# EAGLE design prototype (EAGLE 7.7.0)
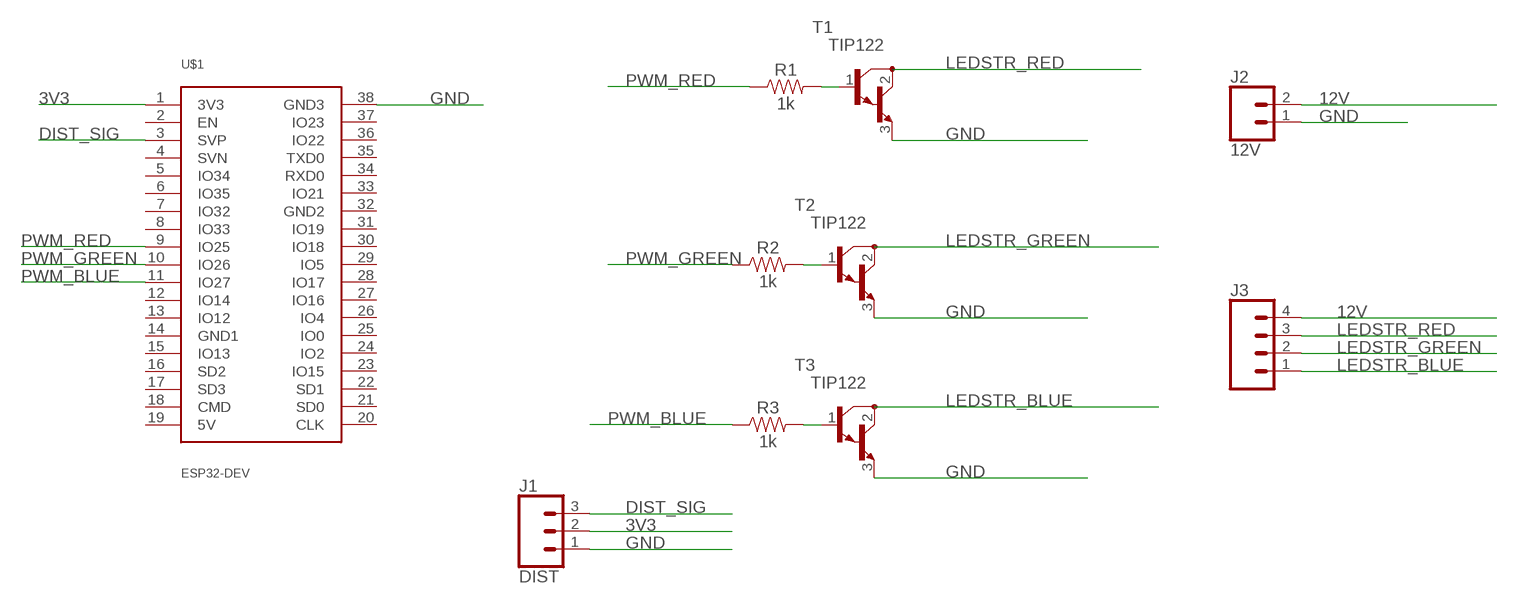
[diagram p0: schematic, sheet 1]

## Parts
J1  DIST  CONN_03LONGPADS  [1X03_LONGPADS]
J2  12V  CONN_02PTH3  [1X02_LONGPADS]
J3  CONN_04LONGPADS  [1X04_LONGPADS]
R1  1k  1KOHM-HORIZ-1/4W-1%  [AXIAL-0.3]
R2  1k  1KOHM-HORIZ-1/4W-1%  [AXIAL-0.3]
R3  1k  1KOHM-HORIZ-1/4W-1%  [AXIAL-0.3]
T1  TIP122  [TO220]
T2  TIP122  [TO220]
T3  TIP122  [TO220]
U$1  ESP32-DEV  [ESP32-DEV]

## Nets
3V3: J1.2 U$1.1(3V3)
12V: J2.2 J3.4
DIST_SIG: J1.3 U$1.3(SVP)
GND: J1.1 J2.1 T1.3(E) T2.3(E) T3.3(E) U$1.38(GND3)
LEDSTR_BLUE: J3.1 T3.2(C)
LEDSTR_GREEN: J3.2 T2.2(C)
LEDSTR_RED: J3.3 T1.2(C)
N$1: R1.P$2 T1.1(B)
N$2: R2.P$2 T2.1(B)
N$3: R3.P$2 T3.1(B)
PWM_BLUE: R3.P$1 U$1.11(IO27)
PWM_GREEN: R2.P$1 U$1.10(IO26)
PWM_RED: R1.P$1 U$1.9(IO25)
Unconnected: U$1.2(EN) U$1.4(SVN) U$1.5(IO34) U$1.6(IO35) U$1.7(IO32) U$1.8(IO33) U$1.12(IO14) U$1.13(IO12) U$1.14(GND1) U$1.15(IO13) U$1.16(SD2) U$1.17(SD3) U$1.18(CMD) U$1.19(5V) U$1.20(CLK) U$1.21(SD0) U$1.22(SD1) U$1.23(IO15) U$1.24(IO2) U$1.25(IO0) U$1.26(IO4) U$1.27(IO16) U$1.28(IO17) U$1.29(IO5) U$1.30(IO18) U$1.31(IO19) U$1.32(GND2) U$1.33(IO21) U$1.34(RXD0) U$1.35(TXD0) U$1.36(IO22) U$1.37(IO23)

## Library data of the parts
J1 = SparkFun-Connectors:CONN_03: Multi connection point. Often used as Generic Header-pin footprint for 0.1 inch spaced/style header connections On any of the 0.1 inch spaced packages, you can populate with these: Break Away Headers - Straight <https://www.sparkfun.com/products/116> (PRT-00116) Break Away Male Headers - Right Angle <https://www.sparkfun.com/products/553> (PRT-00553) Female Headers <https://www.sparkfun.com/products/115> (PRT-00115) Break Away Headers - Machine Pin <https://www.sparkfun.com/products/117> (PRT-00117) Break Away Female Headers - Swiss Machine Pin <https://www.sparkfun.com/products/743> (PRT-00743) Stackable Header - 3 Pin (Female, 0.1") <https://www.sparkfun.com/products/13875> (PRT-13875) For SCREWTERMINALS and SPRING TERMINALS visit here: Screw Terimnals on SparkFun.com <https://www.sparkfun.com/search/results?term=Screw+Terminals> (5mm/3.5mm/2.54mm spacing) This device is also useful as a general connection point to wire up your design to another part of your project. Our various solder wires solder well into these plated through hole pads. Hook-Up Wire - Assortment (Stranded, 22 AWG) <https://www.sparkfun.com/products/11375> (PRT-11375) Hook-Up Wire - Assortment (Solid Core, 22 AWG) <https://www.sparkfun.com/products/11367> (PRT-11367) View the entire wire category on our website here <https://www.sparkfun.com/categories/141> Special notes: Molex polarized connector foot print use with SKU : PRT-08232 with associated crimp pins and housings.
J2 = SparkFun-Connectors:CONN_02: Multi connection point. Often used as Generic Header-pin footprint for 0.1 inch spaced/style header connections On any of the 0.1 inch spaced packages, you can populate with these: Break Away Headers - Straight <https://www.sparkfun.com/products/116> (PRT-00116) Break Away Male Headers - Right Angle <https://www.sparkfun.com/products/553> (PRT-00553) Female Headers <https://www.sparkfun.com/products/115> (PRT-00115) Break Away Headers - Machine Pin <https://www.sparkfun.com/products/117> (PRT-00117) Break Away Female Headers - Swiss Machine Pin <https://www.sparkfun.com/products/743> (PRT-00743) For SCREWTERMINALS and SPRING TERMINALS visit here: Screw Terimnals on SparkFun.com <https://www.sparkfun.com/search/results?term=Screw+Terminals> (5mm/3.5mm/2.54mm spacing) This device is also useful as a general connection point to wire up your design to another part of your project. Our various solder wires solder well into these plated through hole pads. Hook-Up Wire - Assortment (Stranded, 22 AWG) <https://www.sparkfun.com/products/11375> (PRT-11375) Hook-Up Wire - Assortment (Solid Core, 22 AWG) <https://www.sparkfun.com/products/11367> (PRT-11367) View the entire wire category on our website here <https://www.sparkfun.com/categories/141> Special notes: Molex polarized connector foot print use with: PRT-08233 with associated crimp pins and housings. 2.54_SCREWTERM for use with PRT-10571. 3.5mm Screw Terminal footprints for PRT-08084 5mm Screw Terminal footprints for use with PRT-08432
J3 = SparkFun-Connectors:CONN_04: Multi connection point. Often used as Generic Header-pin footprint for 0.1 inch spaced/style header connections On any of the 0.1 inch spaced packages, you can populate with these: Break Away Headers - Straight <https://www.sparkfun.com/products/116> (PRT-00116) Break Away Male Headers - Right Angle <https://www.sparkfun.com/products/553> (PRT-00553) Female Headers <https://www.sparkfun.com/products/115> (PRT-00115) Break Away Headers - Machine Pin <https://www.sparkfun.com/products/117> (PRT-00117) Break Away Female Headers - Swiss Machine Pin <https://www.sparkfun.com/products/743> (PRT-00743) For SCREWTERMINALS and SPRING TERMINALS visit here: Screw Terimnals on SparkFun.com <https://www.sparkfun.com/search/results?term=Screw+Terminals> (5mm/3.5mm/2.54mm spacing) This device is also useful as a general connection point to wire up your design to another part of your project. Our various solder wires solder well into these plated through hole pads. Hook-Up Wire - Assortment (Stranded, 22 AWG) <https://www.sparkfun.com/products/11375> (PRT-11375) Hook-Up Wire - Assortment (Solid Core, 22 AWG) <https://www.sparkfun.com/products/11367> (PRT-11367) View the entire wire category on our website here <https://www.sparkfun.com/categories/141> Special notes: Molex polarized connector foot print use with SKU : PRT-08231 with associated crimp pins and housings. 1MM SMD Version SKU: PRT-10208; PROD_ID: CONN-09696
R1-R3 = SparkFun-Resistors:1KOHM: 1kΩ resistor A resistor is a passive two-terminal electrical component that implements electrical resistance as a circuit element. Resistors act to reduce current flow, and, at the same time, act to lower voltage levels within circuits. - Wikipedia; PROD_ID: RES-12182
T1-T3 = transistor:TIP122: NPN BIPOLAR DARLINGTON TRANSISTOR
U$1 = IAD-Library:ESP32-DEV: Adafruit ESP32 Development Board.

## Board
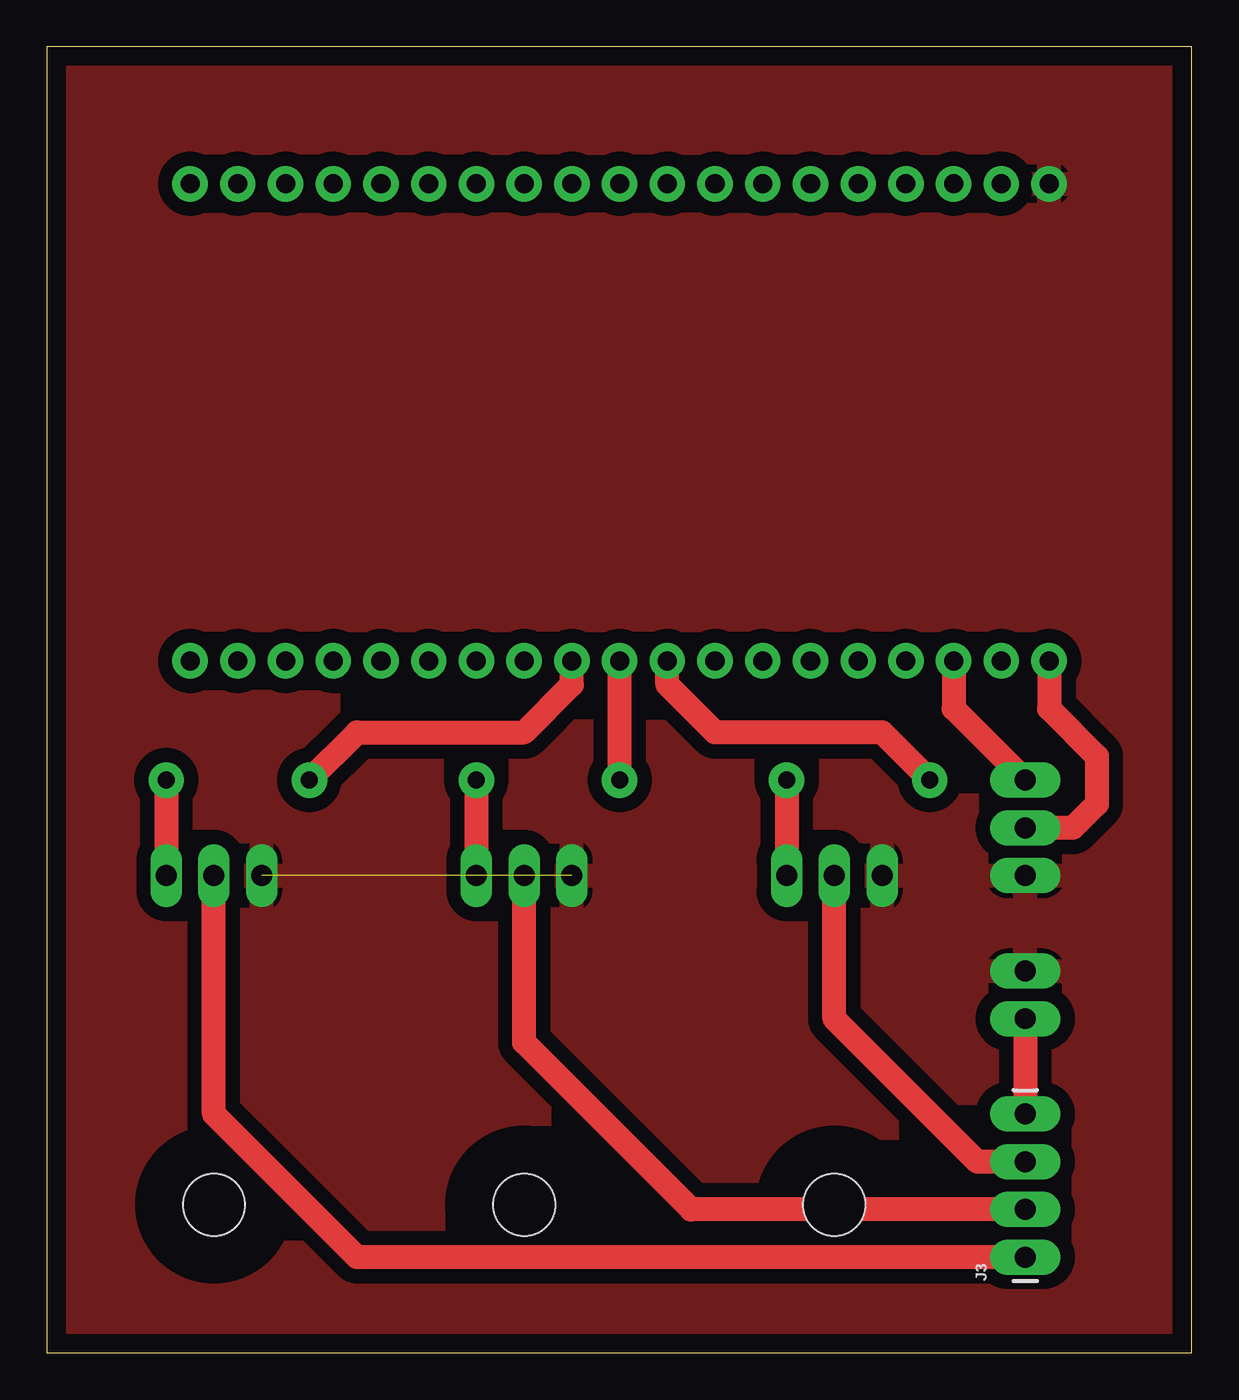
[diagram p1: board, top side]
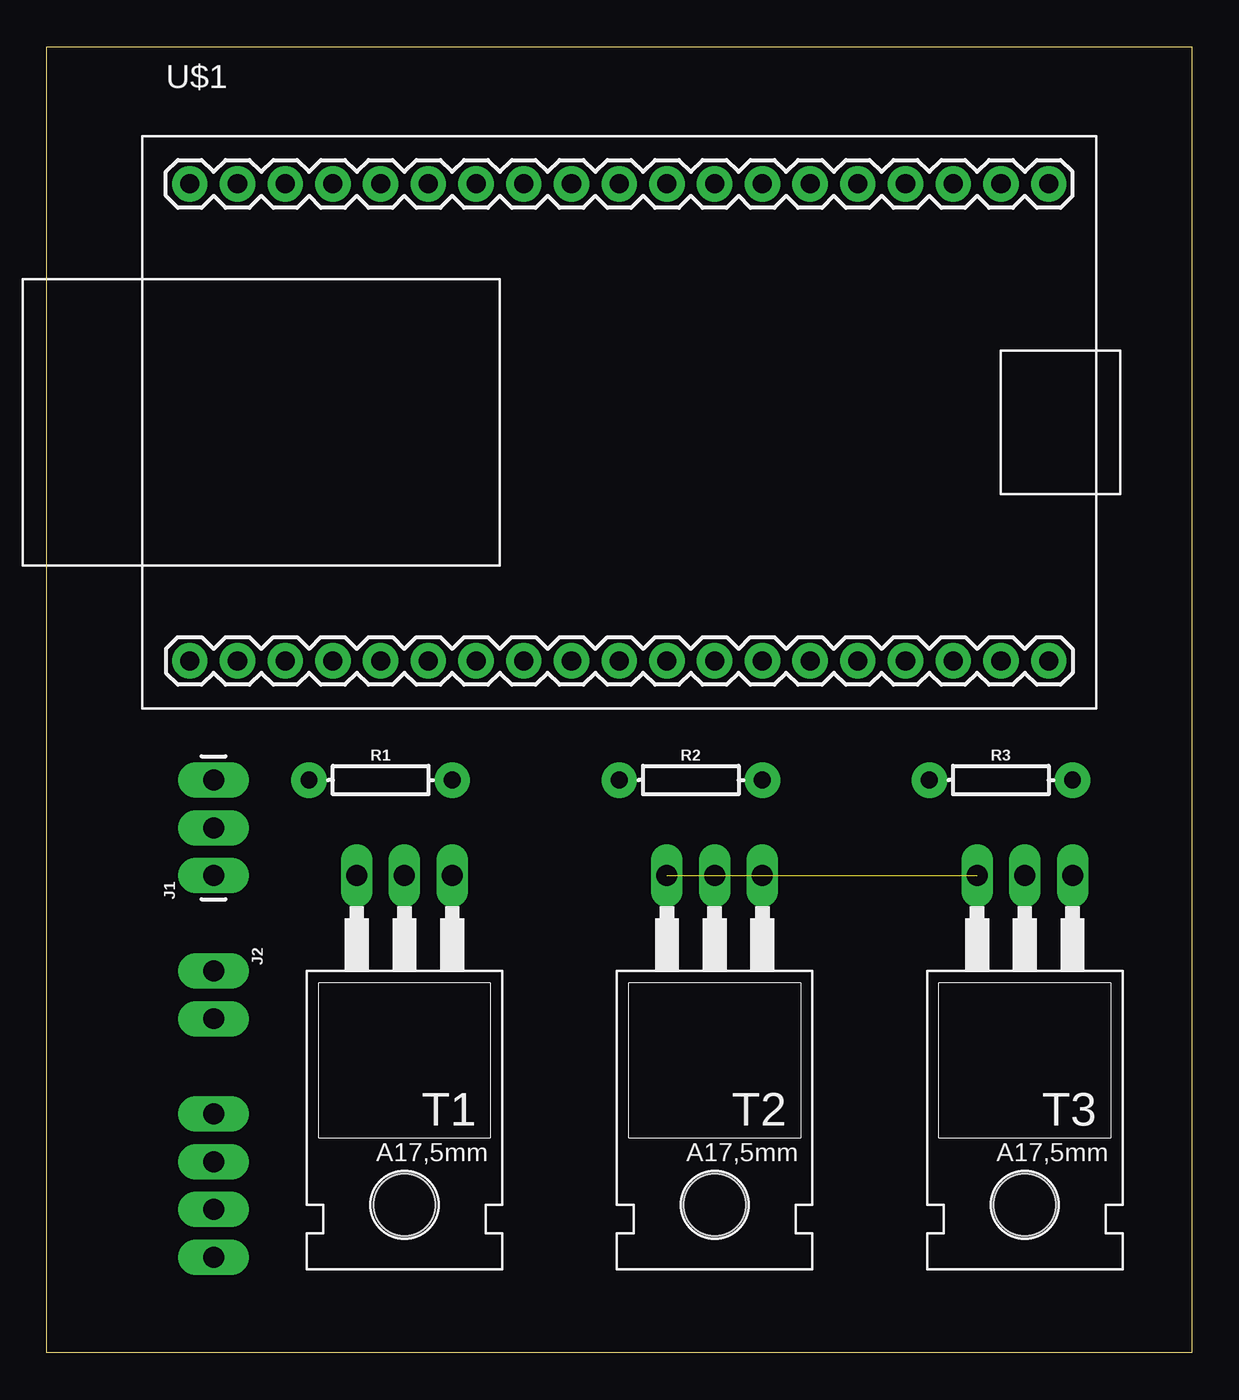
[diagram p2: board, bottom side, seen from below]

Size 60.94 x 69.52 mm. Coordinates in mm from the lower left corner, seen from the top.
Outline: 0,0 60.94,0 60.94,69.52 0,69.52 0,0
Copper layers (1*16): Top 0.035mm / dielectric 1.5mm / Bottom 0.035mm
Design rules "default *": minimum track width 10mil, minimum drill 24mil, track to track 30mil, track to pad 30mil, pad to pad 30mil, via to via 30mil, smd to smd 8mil, copper to edge 40mil, drill to drill 8mil, minimum pad ring 10mil, minimum via ring 8mil, stop-mask expansion 4mil, vias tented up to drill 0mil, thermal gap 10mil

### Footprints (pad centres in the part's own frame; a part is rotated, then mirrored left to right if it is on the bottom)
1X03_LONGPADS = drill 1.118 pad 1.88 long: 1 0,0; 2 2.54,0; 3 5.08,0
1X02_LONGPADS = drill 1.118 pad 1.88 long: 1 0,0; 2 2.54,0
1X04_LONGPADS = drill 1.118 pad 1.88 long: 1 0,0; 2 2.54,0; 3 5.08,0; 4 7.62,0
AXIAL-0.3 = drill 0.9 pad 1.88: P$1 -3.81,0; P$2 3.81,0
TO220 = drill 1.118 long: 1 -2.54,-6.35; 2 0,-6.35; 3 2.54,-6.35 | hole 3.302: 0,11.176
ESP32-DEV = drill 1.016 pad 1.88: 1 -22.86,-12.7; 2 -20.32,-12.7; 3 -17.78,-12.7; 4 -15.24,-12.7; 5 -12.7,-12.7; 6 -10.16,-12.7; 7 -7.62,-12.7; 8 -5.08,-12.7; 9 -2.54,-12.7; 10 0,-12.7; 11 2.54,-12.7; 12 5.08,-12.7; 13 7.62,-12.7; 14 10.16,-12.7; 15 12.7,-12.7; 16 15.24,-12.7; 17 17.78,-12.7; 18 20.32,-12.7; 19 22.86,-12.7; 20 22.86,12.7; 21 20.32,12.7; 22 17.78,12.7; 23 15.24,12.7; 24 12.7,12.7; 25 10.16,12.7; 26 7.62,12.7; 27 5.08,12.7; 28 2.54,12.7; 29 0,12.7; 30 -2.54,12.7; 31 -5.08,12.7; 32 -7.62,12.7; 33 -10.16,12.7; 34 -12.7,12.7; 35 -15.24,12.7; 36 -17.78,12.7; 37 -20.32,12.7; 38 -22.86,12.7

### Placement (x,y rotation side)
J1  52.07,25.4 90 bottom
J2  52.07,20.32 270 bottom
J3  52.07,5.08 90 top
R1  43.18,30.48 0 bottom
R2  26.67,30.48 0 bottom
R3  10.16,30.48 0 bottom
T1  41.91,19.05 180 bottom
T2  25.4,19.05 180 bottom
T3  8.89,19.05 180 bottom
U$1  30.48,49.53 0 bottom

### Tracks (layer width: path | path; a pad name or v marks a point on that pad's centre or on a via)
3V3
  Top 1.27: U$1.1 53.34,34.29 55.88,31.75 55.88,29.21 54.61,27.94 J1.2
12V
  Top 1.27: J2.2 J3.4
DIST_SIG
  Top 1.27: U$1.3 48.26,34.29 J1.3
GND  (1 unrouted)
  pour Top: 0,69.85 0,0 60.96,0 60.96,69.85
LEDSTR_BLUE
  Top 1.27: J3.1 16.51,5.08 8.89,12.7 T3.2
LEDSTR_GREEN
  Top 1.27: J3.2 34.29,7.62 25.4,16.51 T2.2
LEDSTR_RED
  Top 1.27: J3.3 49.53,10.16 41.91,17.78 T1.2
N$1
  Top 1.27: R1.P$2 T1.1
N$2
  Top 1.27: R2.P$2 T2.1
N$3
  Top 1.27: R3.P$2 T3.1
PWM_BLUE
  Top 1.27: R3.P$1 16.51,33.02 25.4,33.02 27.94,35.56 U$1.11
PWM_GREEN
  Top 1.27: R2.P$1 U$1.10
PWM_RED
  Top 1.27: R1.P$1 44.45,33.02 35.56,33.02 33.02,35.56 U$1.9